# EAGLE schematic timbangan bayi (EAGLE 9.6.2)
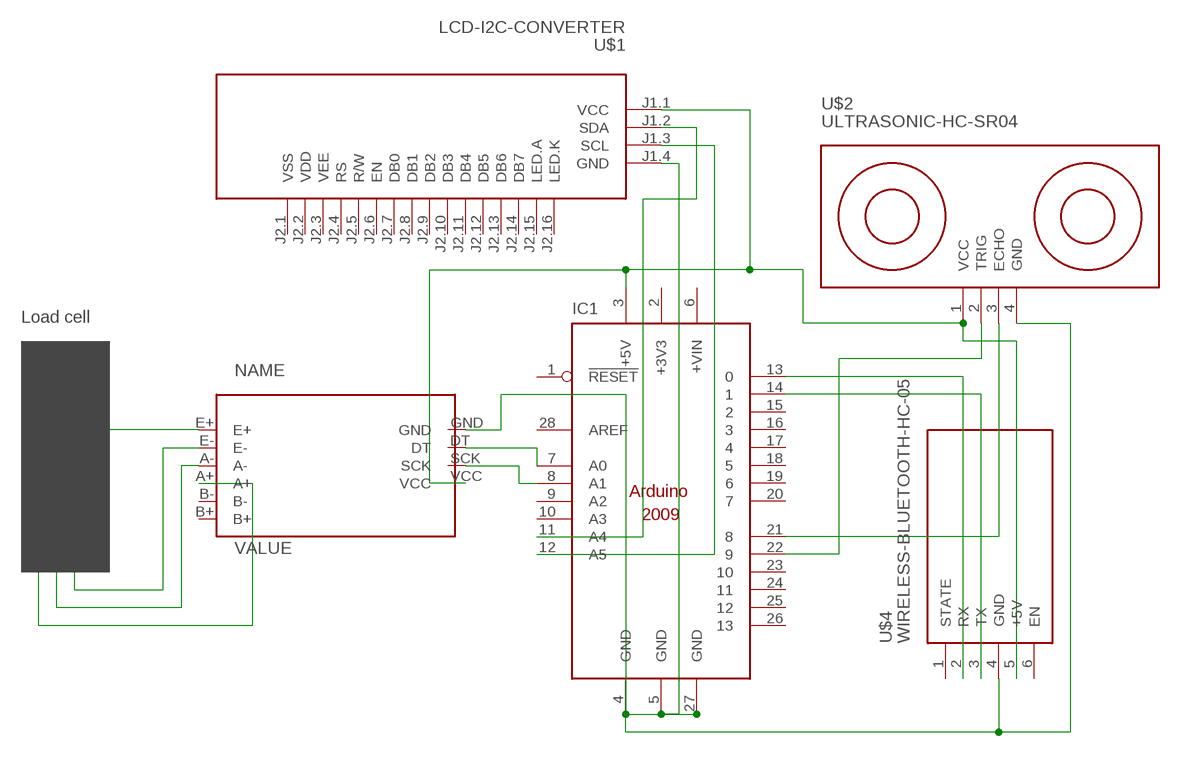
[diagram p0: schematic, sheet 1]

## Parts
IC1  ARDUINO2009_10  [ARDUINO2009]
U$1  LCD-I2C-CONVERTER  [LCD-I2C-CONVERTER]
U$2  ULTRASONIC-HC-SR04  [ULTRASONIC-HC-SR04]
U$3  HX711A  [HX711]
U$4  WIRELESS-BLUETOOTH-HC-05  [WIRELESS-BLUETOOTH-HC-05]

## Nets
N$1: U$3.E+
N$2: U$3.E-
N$3: U$3.A-
N$4: U$3.A+
N$5: IC1.4(GND) IC1.5(GND) IC1.27(GND) U$1.J1.4(GND) U$2.4(GND) U$3.GND U$4.4(GND)
N$6: IC1.7(A0) U$3.DT
N$7: IC1.8(A1) U$3.SCK
N$8: IC1.3(+5V) U$1.J1.1(VCC) U$2.1(VCC) U$3.VCC U$4.5(+5V)
N$9: IC1.13 U$4.2(RX)
N$10: IC1.14 U$4.3(TX)
N$11: IC1.12(A5) U$1.J1.3(SCL)
N$13: IC1.22 U$2.2(TRIG)
N$14: IC1.21 U$2.3(ECHO)
N$16: IC1.11(A4) U$1.J1.2(SDA)
Unconnected: IC1.1(!RESET) IC1.6(+VIN) IC1.9(A2) IC1.10(A3) IC1.15 IC1.16 IC1.17 IC1.18 IC1.19 IC1.20 IC1.23 IC1.24 IC1.25 IC1.26 IC1.28(AREF) U$1.J2.1(VSS) U$1.J2.2(VDD) U$1.J2.3(VEE) U$1.J2.4(RS) U$1.J2.5(R/W) U$1.J2.6(EN) U$1.J2.7(DB0) U$1.J2.8(DB1) U$1.J2.9(DB2) U$1.J2.10(DB3) U$1.J2.11(DB4) U$1.J2.12(DB5) U$1.J2.13(DB6) U$1.J2.14(DB7) U$1.J2.15(LED.A) U$1.J2.16(LED.K) U$3.B+ U$3.B- U$4.1(STATE) U$4.6(EN)

## Notes on the sheet
- Load cell

## Power pins joined to a net without a drawn wire
+3V3: IC1.2(+3V3)

## Library data of the parts
IC1 = arduino:ARDUINO2009_1: The Arduino Duemilanove ("2009") is a microcontroller board based on the ATmega168 or ATmega328. - 14 digital input/output pins (of which 6 can be used as PWM outputs) - 6 analog inputs, a 16 MHz crystal oscillator - USB connection - power jack - ISP header - reset button It contains everything needed to support the microcontroller; simply connect it to a computer with a USB cable or power it with a AC-to-DC adapter or battery to get started http://arduino.cc/en/Main/ArduinoBoardDuemilanove
U$1 = RTC ds3231:LCD-I2C-CONVERTER: I2C Bus to 4-Bit Parallel LCD Interface with LED backlight driver
U$2 = diy-modules:ULTRASONIC-HC-SR04: Ultrasonic Ranging Module HC-SR04 More details available here: http://randomnerdtutorials.com/complete-guide-for-ultrasonic-sensor-hc-sr04/ Click here to find device on ebay.com <http://www.ebay.com/sch/hc+sr04+ultrasonic>
U$3 = HX711:HX711
U$4 = RTC ds3231:WIRELESS-BLUETOOTH-HC-05: Bluetooth Transceiver Module based on HC-05 board Tutorial is available here: https://arduino-info.wikispaces.com/BlueTooth-HC05-HC06-Modules-How-To Click here to find device on ebay.com <http://www.ebay.com/sch/hc-05+module+rs232>